# Altium project main-module-60mmPIC.PrjPcb
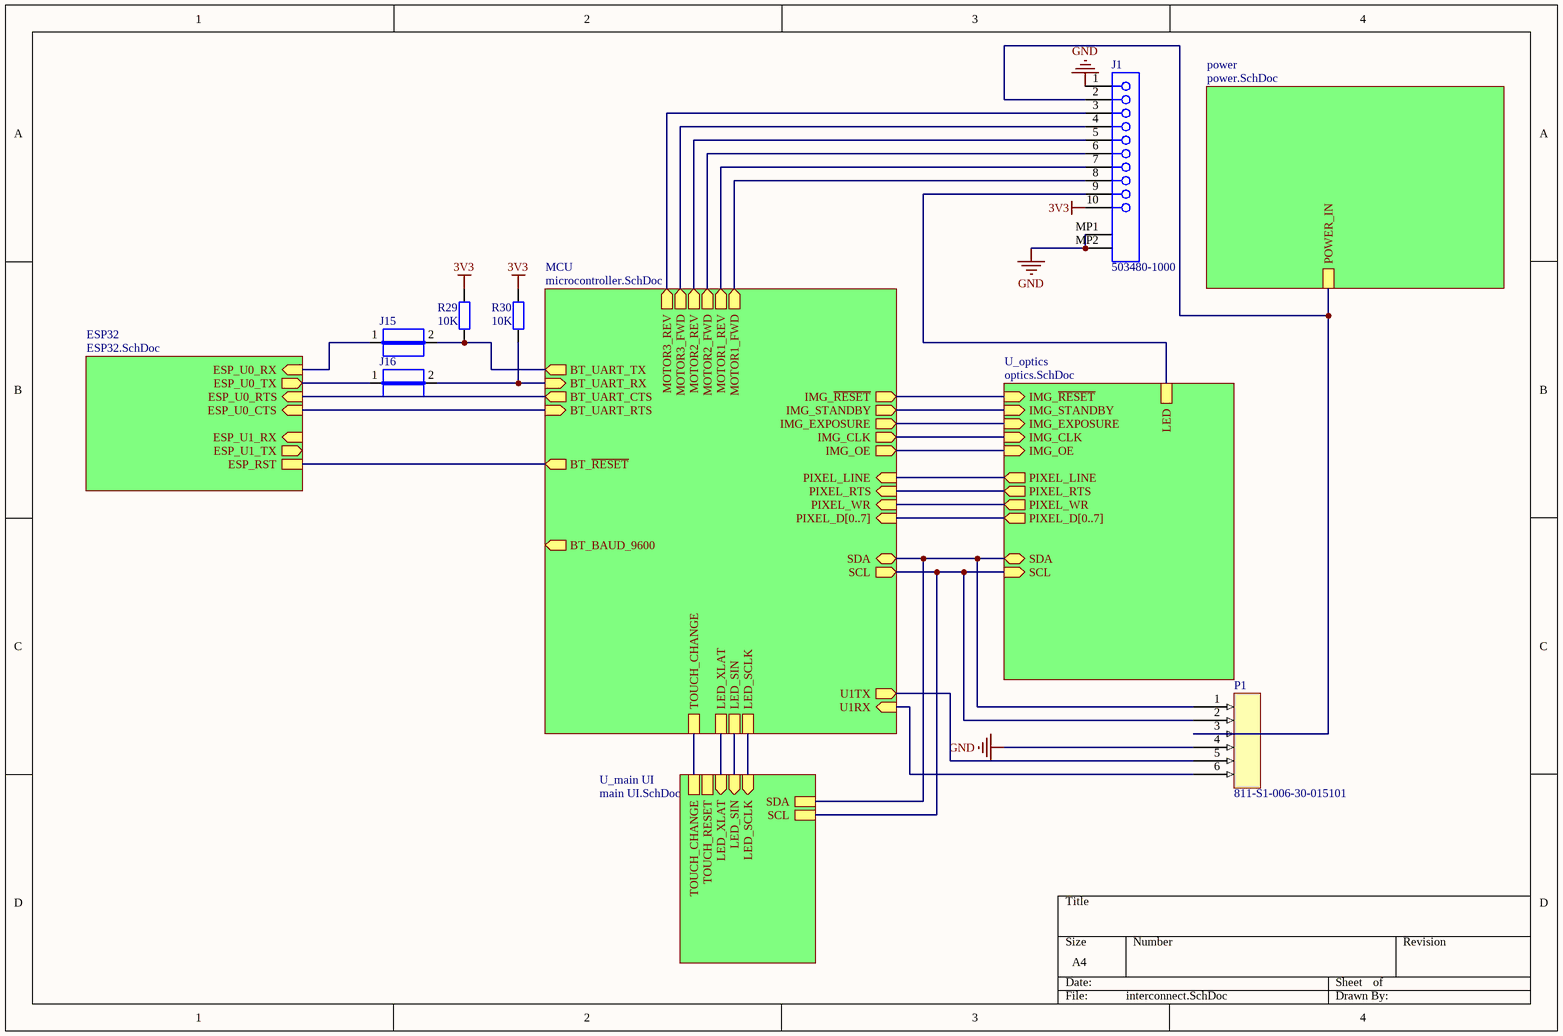
[diagram p0: interconnect.SchDoc]
6 sheets, 102 parts. Net scope: hierarchical (ports join the sheet entries above them; power ports are global).
Board file: main-module-60mmPIC.PcbDoc
Sheets:
  interconnect.SchDoc
    ESP32 = ESP32.SchDoc
    power = power.SchDoc
    MCU = microcontroller.SchDoc
    U_optics = optics.SchDoc
    U_main UI = main UI.SchDoc

## Sheet interconnect.SchDoc
size A4; SheetNumber: 1; SheetTotal: 6

### Parts
J1  503480-1000  [MOLX-503480-1000]
J15  JUMPER  [JUMPER]  (value not drawn)
J16  JUMPER  [JUMPER]  (value not drawn)
P1  811-S1-006-30-015101  [New footprint 1]
R29  10K  [1608[0603]_M]
R30  10K  [1608[0603]_M]

### Sub-sheets
ESP32 = ESP32.SchDoc: ESP_U0_RX (in), ESP_U1_TX (out), ESP_U0_TX (out), ESP_U1_RX (in), ESP_U0_CTS (in), ESP_U0_RTS (in), ESP_RST
MCU = microcontroller.SchDoc: SDA (bidir), IMG_STANDBY (out), IMG_EXPOSURE (out), BT_UART_RTS (in), BT_UART_CTS (out), MOTOR1_FWD (out), MOTOR1_REV (out), MOTOR2_FWD (out), MOTOR2_REV (out), MOTOR3_FWD (out), BT_~{RESET} (out), IMG_~{RESET} (out), IMG_CLK (out), PIXEL_LINE (in), IMG_OE (out), BT_BAUD_9600 (out), PIXEL_RTS (in), PIXEL_WR (in), MOTOR3_REV (out), SCL (out), PIXEL_D[0..7] (in), LED_SIN, TOUCH_CHANGE, LED_XLAT, LED_SCLK, BT_UART_TX (out), BT_UART_RX (in), U1TX (out), U1RX (in)
power = power.SchDoc: POWER_IN
U_main UI = main UI.SchDoc: LED_SCLK (in), LED_SIN (in), LED_XLAT (in), SDA, TOUCH_RESET, TOUCH_CHANGE, SCL
U_optics = optics.SchDoc: IMG_~{RESET} (in), IMG_CLK (in), IMG_EXPOSURE (in), IMG_STANDBY (in), SCL (in), SDA (bidir), PIXEL_WR (out), PIXEL_RTS (out), PIXEL_D[0..7] (out), PIXEL_LINE (out), IMG_OE (in), LED

### Nets
3V3: J1.10 R29.2 R30.2
GND: J1.1 J1.MP1 J1.MP2 P1.4
E32_RST: sheet ESP32/ESP_RST, sheet MCU/BT_~{RESET}
IMG_CLK: sheet MCU/IMG_CLK, sheet U_optics/IMG_CLK
IMG_EXPOSURE: sheet MCU/IMG_EXPOSURE, sheet U_optics/IMG_EXPOSURE
LED_SCLK: sheet MCU/LED_SCLK, sheet U_main UI/LED_SCLK
LED_SIN: sheet MCU/LED_SIN, sheet U_main UI/LED_SIN
LED_XLAT: sheet MCU/LED_XLAT, sheet U_main UI/LED_XLAT
PIXEL_WR: sheet MCU/PIXEL_WR, sheet U_optics/PIXEL_WR
SCL: P1.2 ; sheet MCU/SCL, sheet U_optics/SCL, sheet U_main UI/SCL
SDA: P1.1 ; sheet MCU/SDA, sheet U_optics/SDA, sheet U_main UI/SDA
TOUCH_~{CHANGE}: sheet MCU/TOUCH_CHANGE, sheet U_main UI/TOUCH_CHANGE
U0RXD: J15.1 ; sheet ESP32/ESP_U0_RX
U0TXD: J16.1 ; sheet ESP32/ESP_U0_TX
NetC5_1: J1.2 P1.3 ; sheet power/POWER_IN
NetIC1_4: J15.2 R29.1 ; sheet MCU/BT_UART_TX
NetIC1_5: J16.2 R30.1 ; sheet MCU/BT_UART_RX
NetIC1_6: sheet ESP32/ESP_U0_CTS, sheet MCU/BT_UART_RTS
NetIC1_10: sheet ESP32/ESP_U0_RTS, sheet MCU/BT_UART_CTS
NetIC1_11: P1.6 ; sheet MCU/U1RX
NetIC1_13: P1.5 ; sheet MCU/U1TX
NetIC1_14: J1.8 ; sheet MCU/MOTOR1_FWD
NetIC1_17: J1.7 ; sheet MCU/MOTOR1_REV
NetIC1_18: J1.6 ; sheet MCU/MOTOR2_FWD
NetIC1_21: J1.5 ; sheet MCU/MOTOR2_REV
NetIC1_22: J1.4 ; sheet MCU/MOTOR3_FWD
NetIC1_23: J1.3 ; sheet MCU/MOTOR3_REV
NetIC1_45: sheet MCU/PIXEL_RTS, sheet U_optics/PIXEL_RTS
NetIC1_46: sheet MCU/IMG_OE, sheet U_optics/IMG_OE
NetIC1_50: sheet MCU/IMG_~{RESET}, sheet U_optics/IMG_~{RESET}
NetIC1_56: sheet MCU/IMG_STANDBY, sheet U_optics/IMG_STANDBY
NetIC1_57: sheet MCU/PIXEL_LINE, sheet U_optics/PIXEL_LINE
NetJ1_9: J1.9 ; sheet U_optics/LED

### Buses and harness runs
bus sheet MCU/PIXEL_D[0..7] = sheet U_optics/PIXEL_D[0..7]

### Library data of the parts
J1 = CMP-1241-00115-1: 0.5 mm Pitch Easy-On(TM) BackFlip(TM) Type FPC Connector, 1.0 mm Mated Height, Right Angle, SMT, Dual Contact, 10 Circuits, -40 to 85 degC, ELV and RoHS Compliant, Tape and Reel; Manufacturer: Molex; Durability (mating cycles max): 10; Pitch - Mating Interface: 0.50mm; Material - Plating Mating: Gold; Voltage (Max): 50V AC (RMS)/DC; Polarized to PCB: Yes; PCB Locator: No; Current (Max per Contact): 0.5A; Material - Plating Termination: Gold, Tin; Entry Angle: 90degrees Angle; Mated Height: 1.00mm; Material - Metal: Phosphor Bronze; ComponentLink1Description: Manufacturer URL; PartNumber: 503480-1000; Circuits (Loaded): 10; Packing: Tape and Reel; PackageReference: 503480-1000; ComponentLink2URL: http://www.molex.com/webdocs/datasheets/pdf/en-us/5034801000_FFC_FPC_CONNECTORS.pdf; PackageVersion: Rev. F, 09/2012; ComponentLink3Description: Package Specification; ComponentLink3URL: http://www.molex.com/pdm_docs/sd/5034801000_sd.pdf; PackageDescription: 10-Lead FPC Connector, Pitch 0.5 mm; Stackable: No; Mounting Technology: Surface Mount; ComponentLink2Description: Datasheet; PCB Retention: Yes; Number of Rows: 1; Orientation: Right Angle; Contact Position: Dual; RoHS: TRUE; ComponentLink1URL: http://www.molex.com/molex/index.jsp
J15 J16 = CMP-009-00061-1: Pins: 2
P1 = CMP-002-00071-6: Conn Spring Piston 6POS SMD
R29 R30 = Resistor: Generic Resistor; Value: 10K

## Sheet ESP32.SchDoc
size A4; SheetNumber: 2; SheetTotal: 6
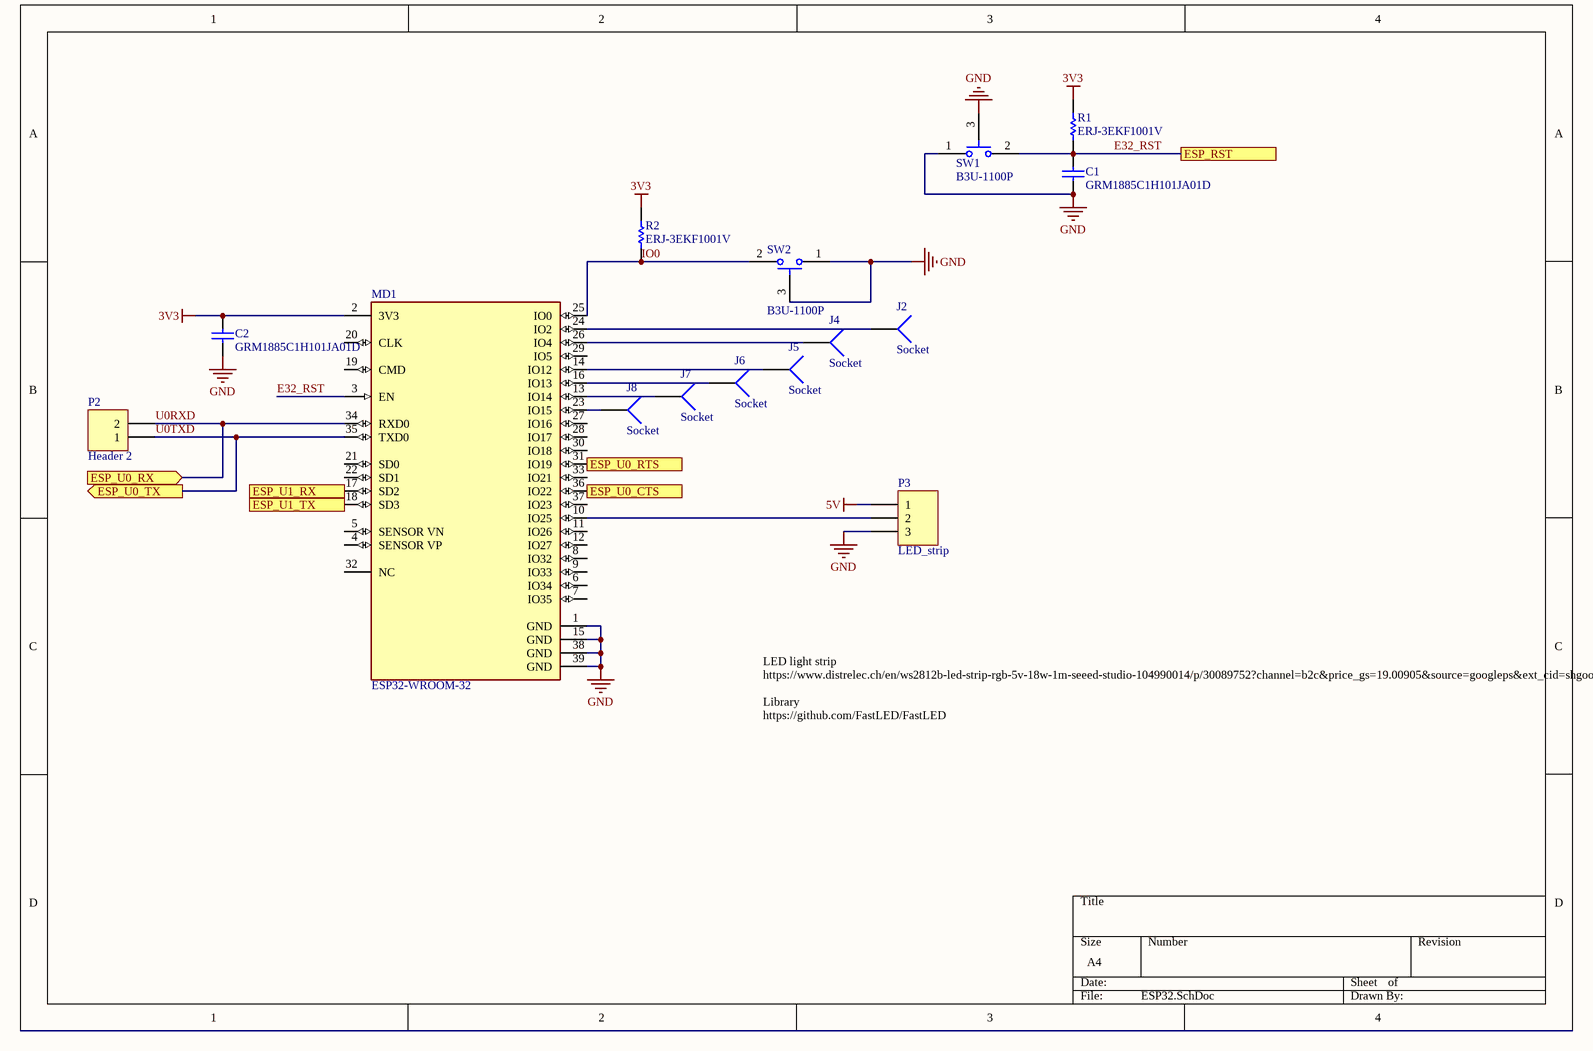
[diagram p1: ESP32.SchDoc]

### Parts
C1  GRM1885C1H101JA01D  [CAPC1608X90X35ML10T15]
C2  GRM1885C1H101JA01D  [CAPC1608X90X35ML10T15]
J2  Socket  [PIN1]
J4  Socket  [PIN1]
J5  Socket  [PIN1]
J6  Socket  [PIN1]
J7  Socket  [PIN1]
J8  Socket  [PIN1]
MD1  ESP32-WROOM-32  [FP-ESP32-WROOM-32-MFG]
P2  Header 2  [HDR1X2]
P3  LED_strip  [HDR1X3]
R1  ERJ-3EKF1001V  [RESC1608X55X30ML15T15]
R2  ERJ-3EKF1001V  [RESC1608X55X30ML15T15]
SW1  B3U-1100P  [FP-B3U-1100P-MFG]
SW2  B3U-1100P  [FP-B3U-1100P-MFG]

### Ports
ESP_RST, ESP_U0_CTS (in), ESP_U0_RTS (in), ESP_U0_RX (in), ESP_U0_TX (out), ESP_U1_RX (in), ESP_U1_TX (out)

### Nets
3V3: C2.2 MD1.2(3V3) R1.2 R2.2
5V: P3.1
GND: C1.1 C2.1 MD1.1(GND) MD1.15(GND) MD1.38(GND) MD1.39(GND) P3.3 SW1.1 SW1.3 SW2.1 SW2.3
E32_RST: C1.2 MD1.3(EN) R1.1 SW1.2 ; port ESP_RST
IO0: MD1.25(IO0) R2.1 SW2.2
U0RXD: MD1.34(RXD0) P2.2 ; port ESP_U0_RX
U0TXD: MD1.35(TXD0) P2.1 ; port ESP_U0_TX
NetIC1_6: MD1.36(IO22) ; port ESP_U0_CTS
NetIC1_10: MD1.31(IO19) ; port ESP_U0_RTS
NetJ2_1: J2.1 MD1.24(IO2)
NetJ4_1: J4.1 MD1.26(IO4)
NetJ5_1: J5.1 MD1.14(IO12)
NetJ6_1: J6.1 MD1.16(IO13)
NetJ7_1: J7.1 MD1.13(IO14)
NetJ8_1: J8.1 MD1.23(IO15)
NetMD1_10: MD1.10(IO25) P3.2
NetMD1_17: MD1.17(SD2) ; port ESP_U1_RX
NetMD1_18: MD1.18(SD3) ; port ESP_U1_TX

Not connected (* = marked no-connect by the designer): MD1 4(SENSOR_VP) 5(SENSOR_VN) 6(IO34) 7(IO35) 8(IO32) 9(IO33) 11(IO26) 12(IO27) 19(CMD) 20(CLK) 21(SD0) 22(SD1) 27(IO16) 28(IO17) 29(IO5) 30(IO18) 32(NC) 33(IO21) 37(IO23)

### Notes on the sheet
- LED light strip
  https://www.distrelec.ch/en/ws2812b-led-strip-rgb-5v-18w-1m-seeed-studio-104990014/p/30089752?channel=b2c&price_gs=19.00905&source=googleps&ext_cid=shgooaqchen-blcss&kw=%7Bkeyword%7D&ext_cid=shgooaqchen-P-CSS-Shopping-Lighting&pi=30089752&gclid=CjwKCAjww-CGBhALEiwAQzWxOvH7Gs9yD2iBi4Gc1DNC2TtA9CMgRWs6OTP8T3pO5lNEQTRO2M92tBoC6-AQAvD_BwE
  Library
  https://github.com/FastLED/FastLED

### Library data of the parts
C1 C2 = CMP-2006-02595-1: Manufacturer: Murata; Part Number: GRM1885C1H101JA01D
MD1 = CMP-194065-000008-1: RX TXRX MOD WIFI SURFACE MOUNT; Frequency: 2.5GHz; Sensitivity: -98dBm; Operating Supply Voltage: 3.6V; Data Rate: 150Mbps; Weight: 0.088185oz; Package Quantity: 550; Min Operating Temperature: -40°C; Mount: Surface Mount; Max Operating Temperature: 85°C; Packaging: Cut Tape; Case/Package: SMD/SMT
P2 = Header 2: Header, 2-Pin; LatestRevisionDate: 17-Jul-2002; LatestRevisionNote: Re-released for DXP Platform.; Publisher: Altium Limited
P3 = Header 3: Header, 3-Pin; LatestRevisionDate: 17-Jul-2002; LatestRevisionNote: Re-released for DXP Platform.; Publisher: Altium Limited
R1 R2 = CMP-2000-00180-1: Manufacturer: Panasonic; Part Number: ERJ-3EKF1001V
SW1 SW2 = CMP-2000-05903-2: SWITCH TACTILE SPST-NO 0.05A 12V; Switch Function: Off-Mom; Operating Force: 1.5N; Mechanical Life: 200000Cycles; Max Current Rating: 50mA; Illumination Type: Non-Illuminated; Actuator Type: Standard; Throw Configuration: SPST; Switch Travel: 0.15mm; Contact Resistance: 100mR; Actuator Length: 0.4mm; Ratings: Dust Proof; Termination: SMD/SMT; Packaging: Tape and Reel; Contact Plating: Silver; Max Operating Temperature: 70°C; Current Rating: 50mA; Electrical Life: 200000Cycles; Voltage Rating (DC): 12V; Length: 3.15mm; Weight: 0.022g; Min Operating Temperature: -25°C; Orientation: Straight; Contact Current Rating: 50mA; Package Quantity: 1; Max Voltage Rating (DC): 12V; Depth: 4mm; Lead Free: Lead Free; Mount: Surface Mount
J2 J4-J8 = Socket: LatestRevisionDate: 17-Jul-2002; LatestRevisionNote: Re-released for DXP Platform.; Publisher: Altium Limited

## Sheet power.SchDoc
size A4; SheetNumber: 3; SheetTotal: 6
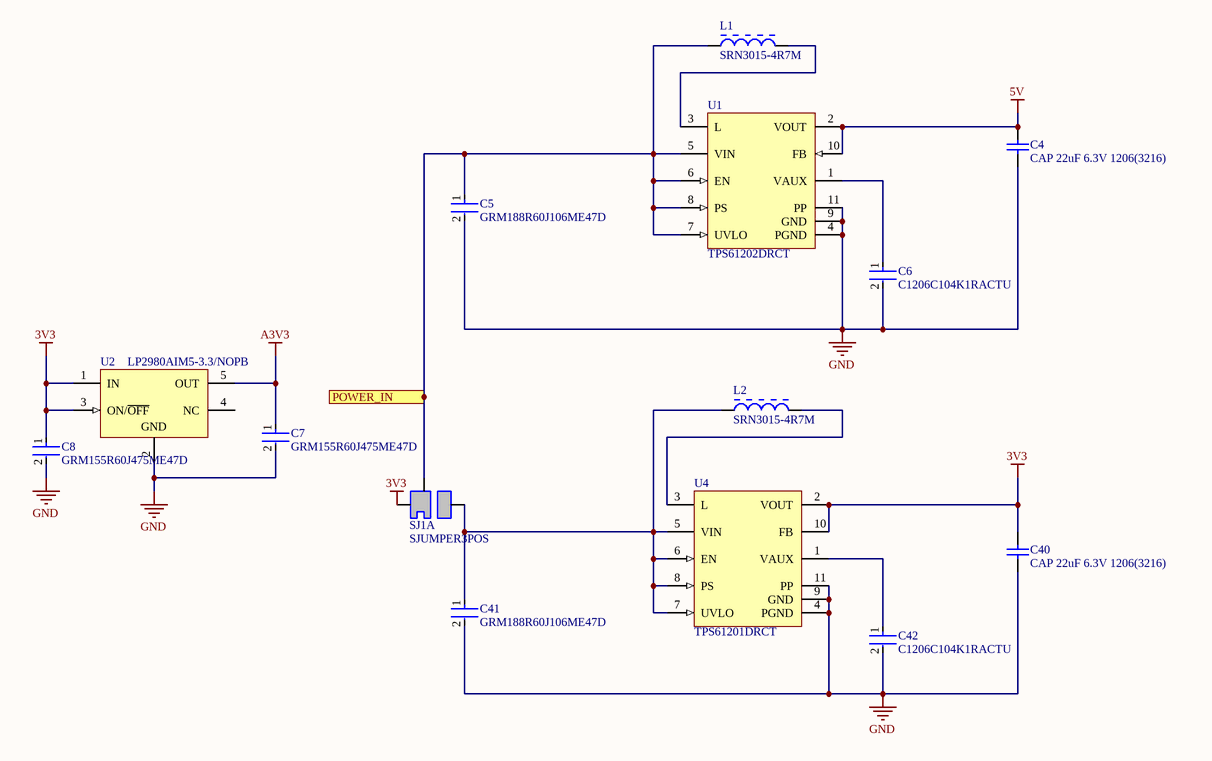
[diagram p2: power.SchDoc]

### Parts
C4  CAP 22uF 6.3V 1206(3216)  [CAPC1206(3216)190_M]
C5  GRM188R60J106ME47D  [FP-GRM188-0_1-e0_2_0_55-MFG]
C6  C1206C104K1RACTU  [FP-C1206C-EB-MFG]
C7  GRM155R60J475ME47D  [FP-GRM155-0_1-IPC_B]
C8  GRM155R60J475ME47D  [FP-GRM155-0_1-IPC_B]
C40  CAP 22uF 6.3V 1206(3216)  [CAPC1206(3216)190_M]
C41  GRM188R60J106ME47D  [FP-GRM188-0_1-e0_2_0_55-MFG]
C42  C1206C104K1RACTU  [FP-C1206C-EB-MFG]
L1  SRN3015-4R7M  [BOUR-SRN3015-2_V]
L2  SRN3015-4R7M  [BOUR-SRN3015-2_V]
SJ1  SJUMPER3POS  [SJUMPER3POS-Footprint-1]  (part A of 2)
U1  TPS61202DRCT  [DRC0010J_V]
U2  LP2980AIM5-3.3/NOPB  [MF05A_L]
U4  TPS61201DRCT  [DRC0010J_V]

### Ports
POWER_IN

### Nets
3V3: C8.1 C40.2 SJ1.1 U2.1(IN) U2.3(ON/~{OFF}) U4.2(VOUT) U4.10(FB)
5V: C4.2 U1.2(VOUT) U1.10(FB)
A3V3: C7.1 U2.5(OUT)
GND: C4.1 C5.2 C6.2 C7.2 C8.2 C40.1 C41.2 C42.2 U1.4(PGND) U1.9(GND) U1.11(PP) U2.2(GND) U4.4(PGND) U4.9(GND) U4.11(PP)
NetC5_1: C5.1 L1.1 SJ1.2 U1.5(VIN) U1.6(EN) U1.7(UVLO) U1.8(PS) ; port POWER_IN
NetC6_1: C6.1 U1.1(VAUX)
NetC41_1: C41.1 L2.1 SJ1.3 U4.5(VIN) U4.6(EN) U4.7(UVLO) U4.8(PS)
NetC42_1: C42.1 U4.1(VAUX)
NetL1_2: L1.2 U1.3(L)
NetL2_2: L2.2 U4.3(L)

Not connected (* = marked no-connect by the designer): U2 4(NC)

### Library data of the parts
C4 C40 = CMP-1037-04986-1: CAP 22uF 6.3V ±20% 1206 (3216 Metric) Thickness 1.9mm SMD; Case-EIA: 1206; Tolerance: Â±20%; Case-Metric: 3216; Value: 22uF; Max Thickness: 1.9 mm; Rated Voltage: 6.3 V; Technology: SMT
C5 C41 = CMP-2006-02792-2: Chip Multilayer Ceramic Capacitors for General Purpose, 0603, 10uF, X5R, 15%, 20%, 6.3V; Packaging: Tape and Reel; Voltage Rating (DC): 6.3V; Width: 0.031inch; Termination: SMD/SMT; Dielectric: X5R; Package Quantity: 4000; Voltage Rating: 6.3V; Capacitance: 10uF; Case/Package: 0603; Min Operating Temperature: -55°C; Voltage: 6.3V; Length: 1.6mm; Thickness: 0.035inch; Lead Free: Lead Free; Depth: 0.8mm; Case Code (Imperial): 0603; Max Operating Temperature: 85°C; Material: Ceramic; Height: 0.8mm; Tolerance: 20%; Mount: Surface Mount; REACH SVHC: No SVHC; Radiation Hardening: No; Case Code (Metric): 1608
C6 C42 = CMP-03020-000153-1: CAP CER 0.1UF 100V X7R 1206; Manufacturer: KEMET; Value: 0.10 μF; Tolerance: 0.1; Material: Ceramic; Temperature Coefficient: 15%; Automotive Grade: Grade 0; Voltage Rating: 100 V; Automotive: Yes; Ipc Land Pattern Name: CAPC320160X78; Device Class L1: Passive Components; ComponentLink2Description: Datasheet; Temperature Range Low: -55°C; Category: Cap; Octopart: https://octopart.com/c1206c104k1ractu-kemet-89521; Height: 0.88mm; Lead Free: Yes; Digikey Description: CAP CER 0.1UF 100V X7R 1206; Mouser Description: CAP CER 0.1UF 100V X7R 1206; Device Class L3: Ceramic Capacitors; Device Class L2: Capacitors; ComponentLink2URL: https://content.kemet.com/datasheets/KEM_C1007_X8R_ULTRA_150C_SMD.pdf; Temperature Range High: +150°C; Temperature Characteristic: X7R; Manufacturer Part Number: C1206C104K1RACTU; RoHS: TRUE; Capacitance: 0.10 μF; Package: C1206C-EB; Temperature: -55°C to +150°C
C7 C8 = CMP-2008-04549-2: Chip Multilayer Ceramic Capacitors for General Purpose, 0402, 4.7uF, X5R, 15%, 20%, 6.3V; Height: 0.5mm; Weight: 0.000212oz; Length: 1mm; Case Code (Metric): 1005; Packaging: Tape and Reel; Termination: SMD/SMT; Dielectric: X5R; Depth: 0.5mm; Case Code (Imperial): 0402; Min Operating Temperature: -55°C; Case/Package: 0402; Voltage: 6.3V; Width: 0.02inch; Capacitance: 4.7uF; Lead Free: Lead Free; Thickness: 0.022inch; Contact Plating: Tin; REACH SVHC: No SVHC; Package Quantity: 10000; Tolerance: 20%; Voltage Rating (DC): 6.3V; Voltage Rating: 6.3V; Mount: Surface Mount; Max Operating Temperature: 85°C
L1 L2 = CMP-0007-00005-1: Semi-shielded Power Inductor, 4.7 uH, +/- 20%, 1.4 A, -40 to 125 degC, 3 x 3 x 1.5 mm SMD, RoHS and Halogen Free, Tape and Reel; Manufacturer: Bourns; SRF Min: 65 MHz; Inductance: 4.7 uH; Isat: 1.2 A; Resistance to Solder Heat: +260 degC for 10 sec.; Rated current: 1.4 A; Inductance tolerance: +/- 20%; DCR Max: 0.136 Ohm; RoHS: TRUE; ComponentLink2Description: Datasheet; PackageDescription: 2-Pin SMD, Body 3 x 3 mm, Height 1.5 mm; ComponentLink2URL: http://www.bourns.com/data/global/pdfs/SRN3015.pdf; ComponentLink1URL: http://www.bourns.com/; Packing: Tape and Reel; Mounting Technology: Surface Mount; ComponentLink3URL: http://www.bourns.com/data/global/pdfs/SRN3015.pdf; PackageReference: SRN3015; Operating Temperature: -40 to 125 degC; DatasheetVersion: Aug-11; ComponentLink1Description: Manufacturer URL; ComponentLink3Description: Package Specification; PartNumber: SRN3015-4R7M
SJ1 = CMP-001-0001-1: 3 pins solder jumper
U1 = CMP-0347-00032-2: Boost Voltage Converter with 0.3 to 5.5 V Input and 5 V Output, -40 to 85 degC, 10-Pin SON (DRC), Green (RoHS & no Sb/Br); Manufacturer: Texas Instruments; Vin(Min)(V): 0.3; Vin(Max)(V): 5.5; Switching Frequency(Max)(kHz): 1250; SubFamily: Step-Up Regulator; Preset Vout(V): 5; Synchronous Rectification: TRUE; Regulated Outputs(#): 1; PackageVersion: revL, Sep-2011; Topology: Boost; PackageDescription: 10-Pin Plastic Small Outline No-Lead, 3 x 3 x 1 mm Body, 0.5 mm Pitch, Exposed Pad; PackageReference: DRC0010J; ComponentLink2Description: Package Specification; ComponentLink1URL: http://www.ti.com/general/docs/lit/getliterature.tsp?genericPartNumber=TPS61202&fileType=pdf; Eco-Plan: Green (RoHS & no Sb/Br); Mounting Technology: Surface Mount; DatasheetVersion: SLVS577B; PartNumber: TPS61202DRCT; Vout(Max)(V): 5; ComponentLink1Description: Datasheet; ComponentLink2URL: http://www.ti.com/litv/pdf/mpds117k; Vout(Min)(V): 5
U2 = CMP-0062-02170-2: Micropower 50 mA Ultra Low-Dropout Regulator, 5-pin SOT-23, Pb-Free; Manufacturer: National Semiconductor; PowerWise: N; CompType: LDO IC; PackageTopMarking: L00A*XTT; PackageReference: MF05A; DatasheetVersion: Sep-2006; PinCount: 5; ComponentLink3Description: MF05A Package Page; ComponentLink1URL: http://www.national.com/ds/LP/LP2980.pdf; PackageDescription: Molded SOT-23, .115 x .063 x .040 in Body, 5 Lead, .0375 in Pitch; RoHS: Y; RevisionNote: Component URLs added; ComponentLink3URL: http://www.national.com/packaging/folders/mf05a.html; PackageVersion: revD, Aug-2008; ComponentLink1Description: LP2980 Datasheet; ComponentLink2Description: LP2980 Web Page; ComponentLink2URL: http://www.national.com/pf/LP/LP2980.html
U4 = CMP-0343-00033-2: Boost Voltage Converter with 0.3 to 5.5 V Input and 3.3 V Output, -40 to 85 degC, 10-Pin SON (DRC), Green (RoHS & no Sb/Br); Manufacturer: Texas Instruments; Switching Frequency(Max)(kHz): 1250; Vin(Min)(V): 0.3; Preset Vout(V): 3.3; Vin(Max)(V): 5.5; Regulated Outputs(#): 1; Synchronous Rectification: TRUE; SubFamily: Step-Up Regulator; ComponentLink2Description: Package Specification; PackageVersion: revL, Sep-2011; DatasheetVersion: SLVS577B; PackageReference: DRC0010J; PackageDescription: 10-Pin Plastic Small Outline No-Lead, 3 x 3 x 1 mm Body, 0.5 mm Pitch, Exposed Pad; Vout(Min)(V): 3.3; ComponentLink1URL: http://www.ti.com/general/docs/lit/getliterature.tsp?genericPartNumber=TPS61201&fileType=pdf; ComponentLink1Description: Datasheet; Topology: Boost; Mounting Technology: Surface Mount; ComponentLink2URL: http://www.ti.com/litv/pdf/mpds117k; PartNumber: TPS61201DRCT; Eco-Plan: Green (RoHS & no Sb/Br); Vout(Max)(V): 3.3

## Sheet microcontroller.SchDoc
size A4; SheetNumber: 4; SheetTotal: 6
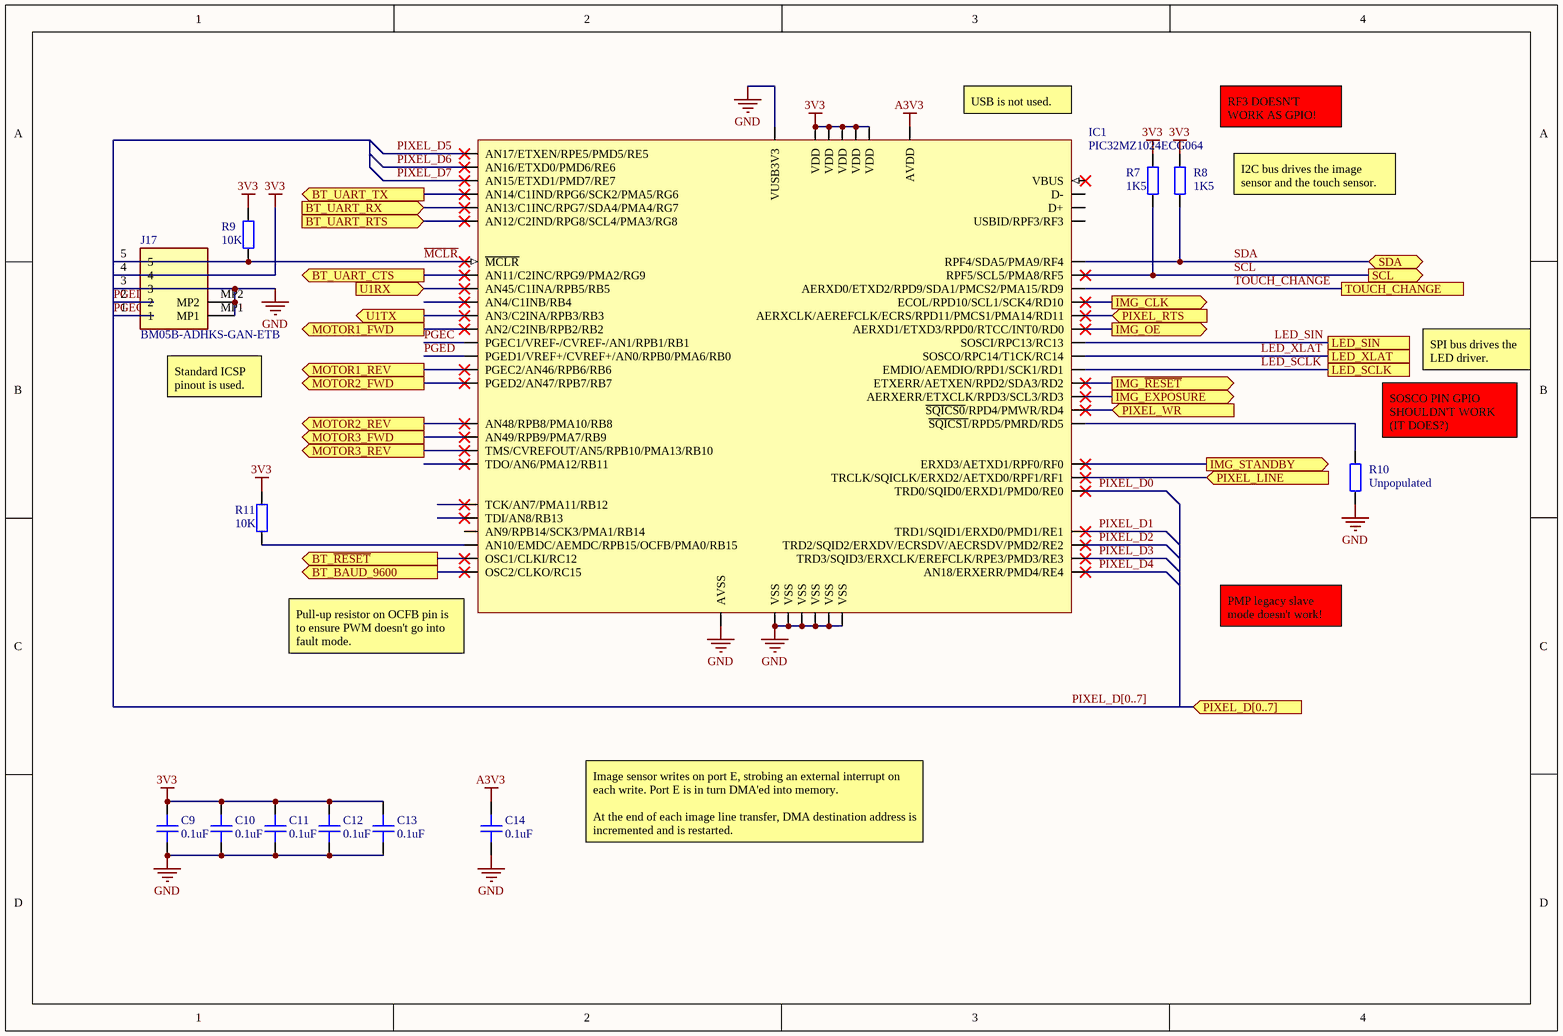
[diagram p3: microcontroller.SchDoc]

### Parts
C9  0.1uF  [1608[0603]_M]
C10  0.1uF  [1608[0603]_M]
C11  0.1uF  [1608[0603]_M]
C12  0.1uF  [1608[0603]_M]
C13  0.1uF  [1608[0603]_M]
C14  0.1uF  [1608[0603]_M]
IC1  PIC32MZ1024ECG064  [TQFP-64_M]
J17  BM05B-ADHKS-GAN-ETB  [BM05BADHKSGANETB]
R7  1K5  [1608[0603]_M]
R8  1K5  [1608[0603]_M]
R9  10K  [1608[0603]_M]
R10  Unpopulated  [1608[0603]_M]
R11  10K  [1608[0603]_M]

### Ports
BT_BAUD_9600 (out), BT_UART_CTS (out), BT_UART_RTS (in), BT_UART_RX (in), BT_UART_TX (out), BT_~{RESET} (out), IMG_CLK (out), IMG_EXPOSURE (out), IMG_OE (out), IMG_STANDBY (out), IMG_~{RESET} (out), LED_SCLK, LED_SIN, LED_XLAT, MOTOR1_FWD (out), MOTOR1_REV (out), MOTOR2_FWD (out), MOTOR2_REV (out), MOTOR3_FWD (out), MOTOR3_REV (out), PIXEL_D[0..7] (in), PIXEL_LINE (in), PIXEL_RTS (in), PIXEL_WR (in), SCL (out), SDA (bidir), TOUCH_CHANGE, U1RX (in), U1TX (out)

### Nets
3V3: C9.2 C10.2 C11.2 C12.2 C13.2 IC1.8(VDD) IC1.26(VDD) IC1.39(VDD) IC1.54(VDD) IC1.60(VDD) J17.4 R7.2 R8.2 R9.2 R11.2
A3V3: C14.2 IC1.19(AVDD)
GND: C9.1 C10.1 C11.1 C12.1 C13.1 C14.1 IC1.7(VSS) IC1.20(AVSS) IC1.25(VSS) IC1.34(VUSB3V3) IC1.35(VSS) IC1.40(VSS) IC1.55(VSS) IC1.59(VSS) J17.3 J17.MP1 J17.MP2 R10.1
E32_RST: IC1.31(OSC1/CLKI/RC12) ; port BT_~{RESET}
IMG_CLK: IC1.44(ECOL/RPD10/SCL1/SCK4/RD10) ; port IMG_CLK
IMG_EXPOSURE: IC1.51(AERXERR/ETXCLK/RPD3/SCL3/RD3) ; port IMG_EXPOSURE
LED_SCLK: IC1.49(EMDIO/AEMDIO/RPD1/SCK1/RD1) ; port LED_SCLK
LED_SIN: IC1.47(SOSCI/RPC13/RC13) ; port LED_SIN
LED_XLAT: IC1.48(SOSCO/RPC14/T1CK/RC14) ; port LED_XLAT
~{MCLR}: IC1.9(~{MCLR}) J17.5 R9.1
PGEC: IC1.15(PGEC1/VREF-/CVREF-/AN1/RPB1/RB1) J17.1
PGED: IC1.16(PGED1/VREF+/CVREF+/AN0/RPB0/PMA6/RB0) J17.2
PIXEL_D0: IC1.58(TRD0/SQID0/ERXD1/PMD0/RE0)
PIXEL_D1: IC1.61(TRD1/SQID1/ERXD0/PMD1/RE1)
PIXEL_D2: IC1.62(TRD2/SQID2/ERXDV/ECRSDV/AECRSDV/PMD2/RE2)
PIXEL_D3: IC1.63(TRD3/SQID3/ERXCLK/EREFCLK/RPE3/PMD3/RE3)
PIXEL_D4: IC1.64(AN18/ERXERR/PMD4/RE4)
PIXEL_D5: IC1.1(AN17/ETXEN/RPE5/PMD5/RE5)
PIXEL_D6: IC1.2(AN16/ETXD0/PMD6/RE6)
PIXEL_D7: IC1.3(AN15/ETXD1/PMD7/RE7)
PIXEL_WR: IC1.52(~{SQICS0}/RPD4/PMWR/RD4) ; port PIXEL_WR
SCL: IC1.42(RPF5/SCL5/PMA8/RF5) R7.1 ; port SCL
SDA: IC1.41(RPF4/SDA5/PMA9/RF4) R8.1 ; port SDA
TOUCH_~{CHANGE}: IC1.43(AERXD0/ETXD2/RPD9/SDA1/PMCS2/PMA15/RD9) ; port TOUCH_CHANGE
NetIC1_4: IC1.4(AN14/C1IND/RPG6/SCK2/PMA5/RG6) ; port BT_UART_TX
NetIC1_5: IC1.5(AN13/C1INC/RPG7/SDA4/PMA4/RG7) ; port BT_UART_RX
NetIC1_6: IC1.6(AN12/C2IND/RPG8/SCL4/PMA3/RG8) ; port BT_UART_RTS
NetIC1_10: IC1.10(AN11/C2INC/RPG9/PMA2/RG9) ; port BT_UART_CTS
NetIC1_11: IC1.11(AN45/C1INA/RPB5/RB5) ; port U1RX
NetIC1_13: IC1.13(AN3/C2INA/RPB3/RB3) ; port U1TX
NetIC1_14: IC1.14(AN2/C2INB/RPB2/RB2) ; port MOTOR1_FWD
NetIC1_17: IC1.17(PGEC2/AN46/RPB6/RB6) ; port MOTOR1_REV
NetIC1_18: IC1.18(PGED2/AN47/RPB7/RB7) ; port MOTOR2_FWD
NetIC1_21: IC1.21(AN48/RPB8/PMA10/RB8) ; port MOTOR2_REV
NetIC1_22: IC1.22(AN49/RPB9/PMA7/RB9) ; port MOTOR3_FWD
NetIC1_23: IC1.23(TMS/CVREFOUT/AN5/RPB10/PMA13/RB10) ; port MOTOR3_REV
NetIC1_30: IC1.30(AN10/EMDC/AEMDC/RPB15/OCFB/PMA0/RB15) R11.1
NetIC1_32: IC1.32(OSC2/CLKO/RC15) ; port BT_BAUD_9600
NetIC1_45: IC1.45(AERXCLK/AEREFCLK/ECRS/RPD11/PMCS1/PMA14/RD11) ; port PIXEL_RTS
NetIC1_46: IC1.46(AERXD1/ETXD3/RPD0/RTCC/INT0/RD0) ; port IMG_OE
NetIC1_50: IC1.50(ETXERR/AETXEN/RPD2/SDA3/RD2) ; port IMG_~{RESET}
NetIC1_53: IC1.53(~{SQICS1}/RPD5/PMRD/RD5) R10.2
NetIC1_56: IC1.56(ERXD3/AETXD1/RPF0/RF0) ; port IMG_STANDBY
NetIC1_57: IC1.57(TRCLK/SQICLK/ERXD2/AETXD0/RPF1/RF1) ; port PIXEL_LINE

Not connected (* = marked no-connect by the designer): IC1 12(AN4/C1INB/RB4)* 24(TDO/AN6/PMA12/RB11)* 27(TCK/AN7/PMA11/RB12)* 28(TDI/AN8/RB13)* 29(AN9/RPB14/SCK3/PMA1/RB14) 33(VBUS)* 36(D-) 37(D+) 38(USBID/RPF3/RF3)

### Buses and harness runs
bus PIXEL_D[0..7] = port PIXEL_D[0..7]

### Notes on the sheet
- (near IC1) USB is not used.
- RF3 DOESN'T WORK AS GPIO!
- I2C bus drives the image sensor and the touch sensor.
- SPI bus drives the LED driver.
- (near J17) Standard ICSP pinout is used.
- (near R10) SOSCO PIN GPIO SHOULDN'T WORK (IT DOES?)
- (near IC1) Pull-up resistor on OCFB pin is to ensure PWM doesn't go into fault mode.
- PMP legacy slave mode doesn't work!
- Image sensor writes on port E, strobing an external interrupt on each write. Port E is in turn DMA'ed into memory.
  At the end of each image line transfer, DMA destination address is incremented and is restarted.

### Library data of the parts
C9-C14 = Capacitor: Generic Capacitor; Value: 0.1uF
IC1 = CMP-042-000001-1: 32-bit Microcontroller; Source: PIC.SchLib; Design Item ID: PIC32MZ1024ECG064
J17 = BM05B-ADHKS-GAN-ETB: Connector; Manufacturer_Name: JST (JAPAN SOLDERLESS TERMINALS); Datasheet Link: http://www.jst-mfg.com/product/pdf/eng/eADH.pdf?5efba42839880; Height: 1.9mm; Manufacturer_Part_Number: BM05B-ADHKS-GAN-ETB
R7-R11 = Resistor: Generic Resistor
  R7 R8: Value: 1K5
  R9 R11: Value: 10K
  R10: Value: Unpopulated

## Sheet optics.SchDoc
size A4; SheetNumber: 5; SheetTotal: 6
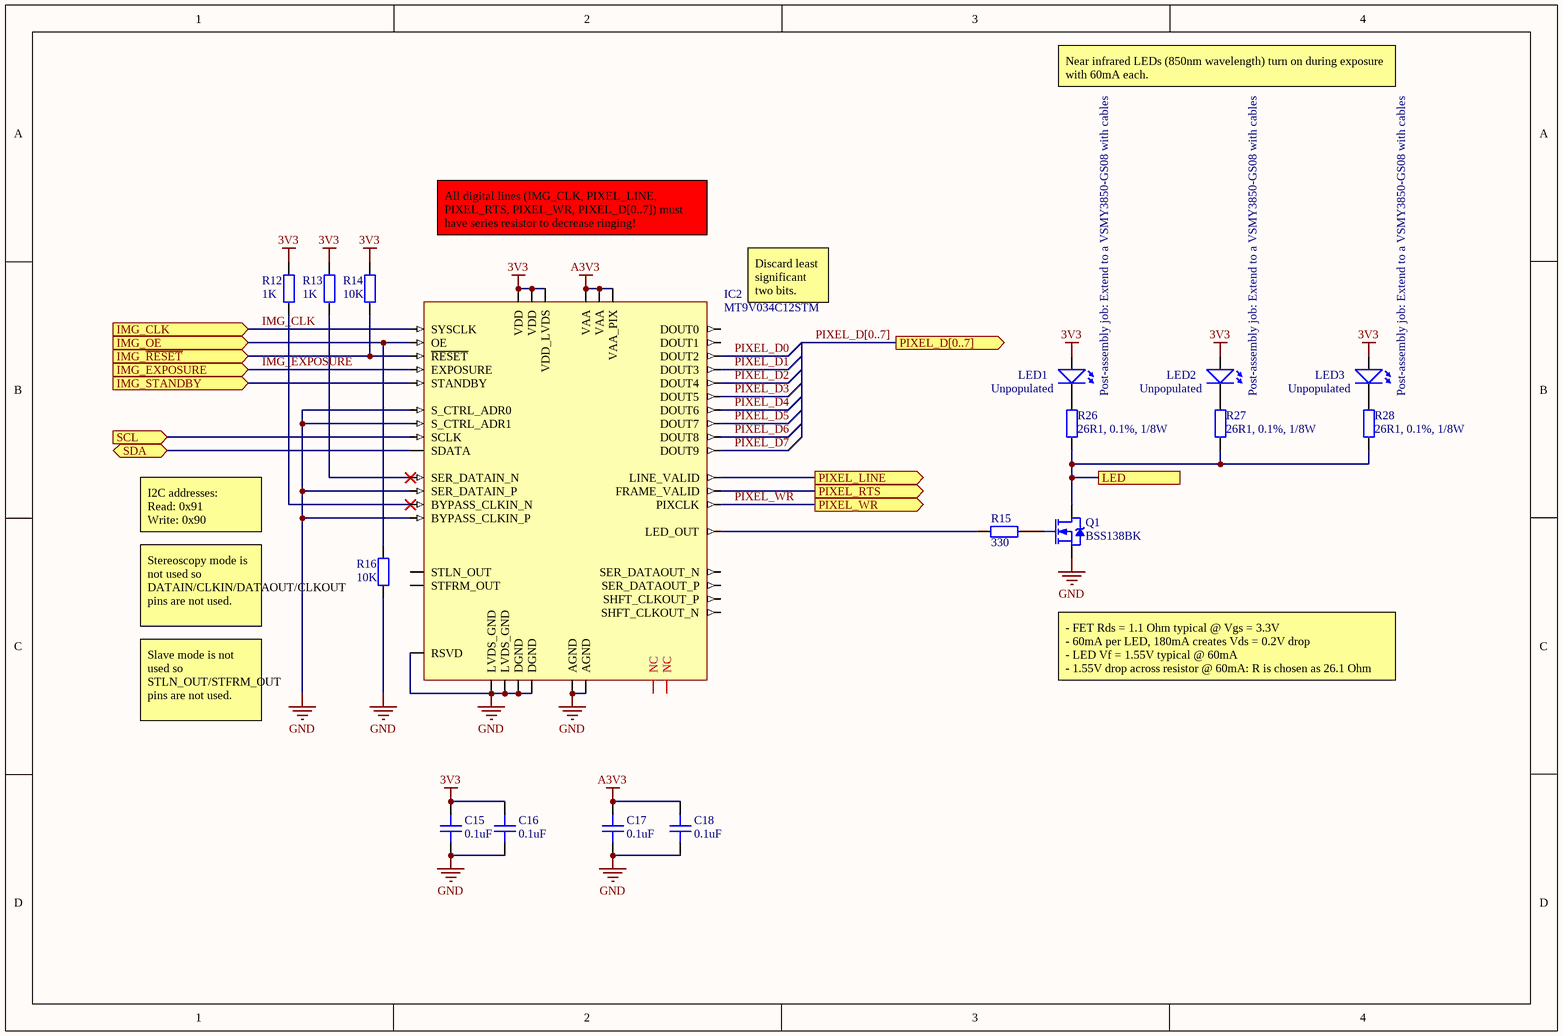
[diagram p4: optics.SchDoc]

### Parts
C15  0.1uF  [1608[0603]_M]
C16  0.1uF  [1608[0603]_M]
C17  0.1uF  [1608[0603]_M]
C18  0.1uF  [1608[0603]_M]
IC2  MT9V034C12STM  [CLCC-48_m]
LED1  Unpopulated  Post-assembly job: Extend to a VSMY3850-GS08 with cables  [CABLE-TERMINAL1x2]
LED2  Unpopulated  Post-assembly job: Extend to a VSMY3850-GS08 with cables  [CABLE-TERMINAL1x2]
LED3  Unpopulated  Post-assembly job: Extend to a VSMY3850-GS08 with cables  [CABLE-TERMINAL1x2]
Q1  BSS138BK  [SOT23-3_N]
R12  1K  [1608[0603]_M]
R13  1K  [1608[0603]_M]
R14  10K  [1608[0603]_M]
R15  330  [1608[0603]_M]
R16  10K  [1608[0603]_M]
R26  26R1, 0.1%, 1/8W  [2012[0805]_M]
R27  26R1, 0.1%, 1/8W  [2012[0805]_M]
R28  26R1, 0.1%, 1/8W  [2012[0805]_M]

### Ports
IMG_CLK (in), IMG_EXPOSURE (in), IMG_OE (in), IMG_STANDBY (in), IMG_~{RESET} (in), LED, PIXEL_D[0..7] (out), PIXEL_LINE (out), PIXEL_RTS (out), PIXEL_WR (out), SCL (in), SDA (bidir)

### Nets
3V3: C15.2 C16.2 IC2.1(VDD) IC2.6(VDD_LVDS) IC2.14(VDD) LED1.A LED2.A LED3.A R12.2 R13.2 R14.2
A3V3: C17.2 C18.2 IC2.35(VAA) IC2.39(VAA) IC2.40(VAA_PIX)
GND: C15.1 C16.1 C17.1 C18.1 IC2.7(LVDS_GND) IC2.9(BYPASS_CLKIN_P) IC2.11(SER_DATAIN_P) IC2.12(LVDS_GND) IC2.13(DGND) IC2.29(RSVD) IC2.30(S_CTRL_ADR0) IC2.31(S_CTRL_ADR1) IC2.34(AGND) IC2.38(AGND) IC2.48(DGND) Q1.S R16.1
IMG_CLK: IC2.47(SYSCLK) ; port IMG_CLK
IMG_EXPOSURE: IC2.23(EXPOSURE) ; port IMG_EXPOSURE
PIXEL_D0: IC2.43(DOUT2)
PIXEL_D1: IC2.42(DOUT3)
PIXEL_D2: IC2.41(DOUT4)
PIXEL_D3: IC2.15(DOUT5)
PIXEL_D4: IC2.16(DOUT6)
PIXEL_D5: IC2.17(DOUT7)
PIXEL_D6: IC2.18(DOUT8)
PIXEL_D7: IC2.19(DOUT9)
PIXEL_WR: IC2.46(PIXCLK) ; port PIXEL_WR
SCL: IC2.25(SCLK) ; port SCL
SDA: IC2.24(SDATA) ; port SDA
NetIC1_45: IC2.21(FRAME_VALID) ; port PIXEL_RTS
NetIC1_46: IC2.28(OE) R16.2 ; port IMG_OE
NetIC1_50: IC2.32(~{RESET}) R14.1 ; port IMG_~{RESET}
NetIC1_56: IC2.33(STANDBY) ; port IMG_STANDBY
NetIC1_57: IC2.20(LINE_VALID) ; port PIXEL_LINE
NetIC2_8: IC2.8(BYPASS_CLKIN_N) R12.1
NetIC2_10: IC2.10(SER_DATAIN_N) R13.1
NetIC2_27: IC2.27(LED_OUT) R15.1
NetJ1_9: Q1.D R26.1 R27.1 R28.1 ; port LED
NetLED1_K: LED1.K R26.2
NetLED2_K: LED2.K R27.2
NetLED3_K: LED3.K R28.2
NetQ1_G: Q1.G R15.2

Not connected (* = marked no-connect by the designer): IC2 2(SHFT_CLKOUT_N) 3(SHFT_CLKOUT_P) 4(SER_DATAOUT_P) 5(SER_DATAOUT_N) 22(STLN_OUT) 26(STFRM_OUT) 36(NC) 37(NC) 44(DOUT1) 45(DOUT0)

### Buses and harness runs
bus PIXEL_D[0..7] = port PIXEL_D[0..7]

### Notes on the sheet
- Near infrared LEDs (850nm wavelength) turn on during exposure with 60mA each.
- All digital lines (IMG_CLK, PIXEL_LINE, PIXEL_RTS, PIXEL_WR, PIXEL_D[0..7]) must have series resistor to decrease ringing!
- (near IC2) Discard least significant two bits.
- I2C addresses:
  Read: 0x91
  Write: 0x90
- Stereoscopy mode is not used so DATAIN/CLKIN/DATAOUT/CLKOUT pins are not used.
- Slave mode is not used so STLN_OUT/STFRM_OUT pins are not used.
- - FET Rds = 1.1 Ohm typical @ Vgs = 3.3V
  - 60mA per LED, 180mA creates Vds = 0.2V drop
  - LED Vf = 1.55V typical @ 60mA
  - 1.55V drop across resistor @ 60mA: R is chosen as 26.1 Ohm

### Library data of the parts
C15-C18 = Capacitor: Generic Capacitor; Value: 0.1uF
IC2 = CMP-025-000000-1: 1/3" WVGA CMOS Image Sensor; Source: ImageSensor.SchLib; Design Item ID: MT9V034C12STM
LED1-LED3 = LED: Generic LED; pin to pad: A>1 K>2; Value: Unpopulated
Q1 = MOSFET-N_BodyDiode: N-channel MOSFET with body diode drawn; pin to pad: D>3 G>1 S>2
R12-R16 R26-R28 = Resistor: Generic Resistor
  R12 R13: Value: 1K
  R14 R16: Value: 10K
  R15: Value: 330
  R26-R28: Value: 26R1, 0.1%, 1/8W

## Sheet main UI.SchDoc
size A4; SheetNumber: 6; SheetTotal: 6
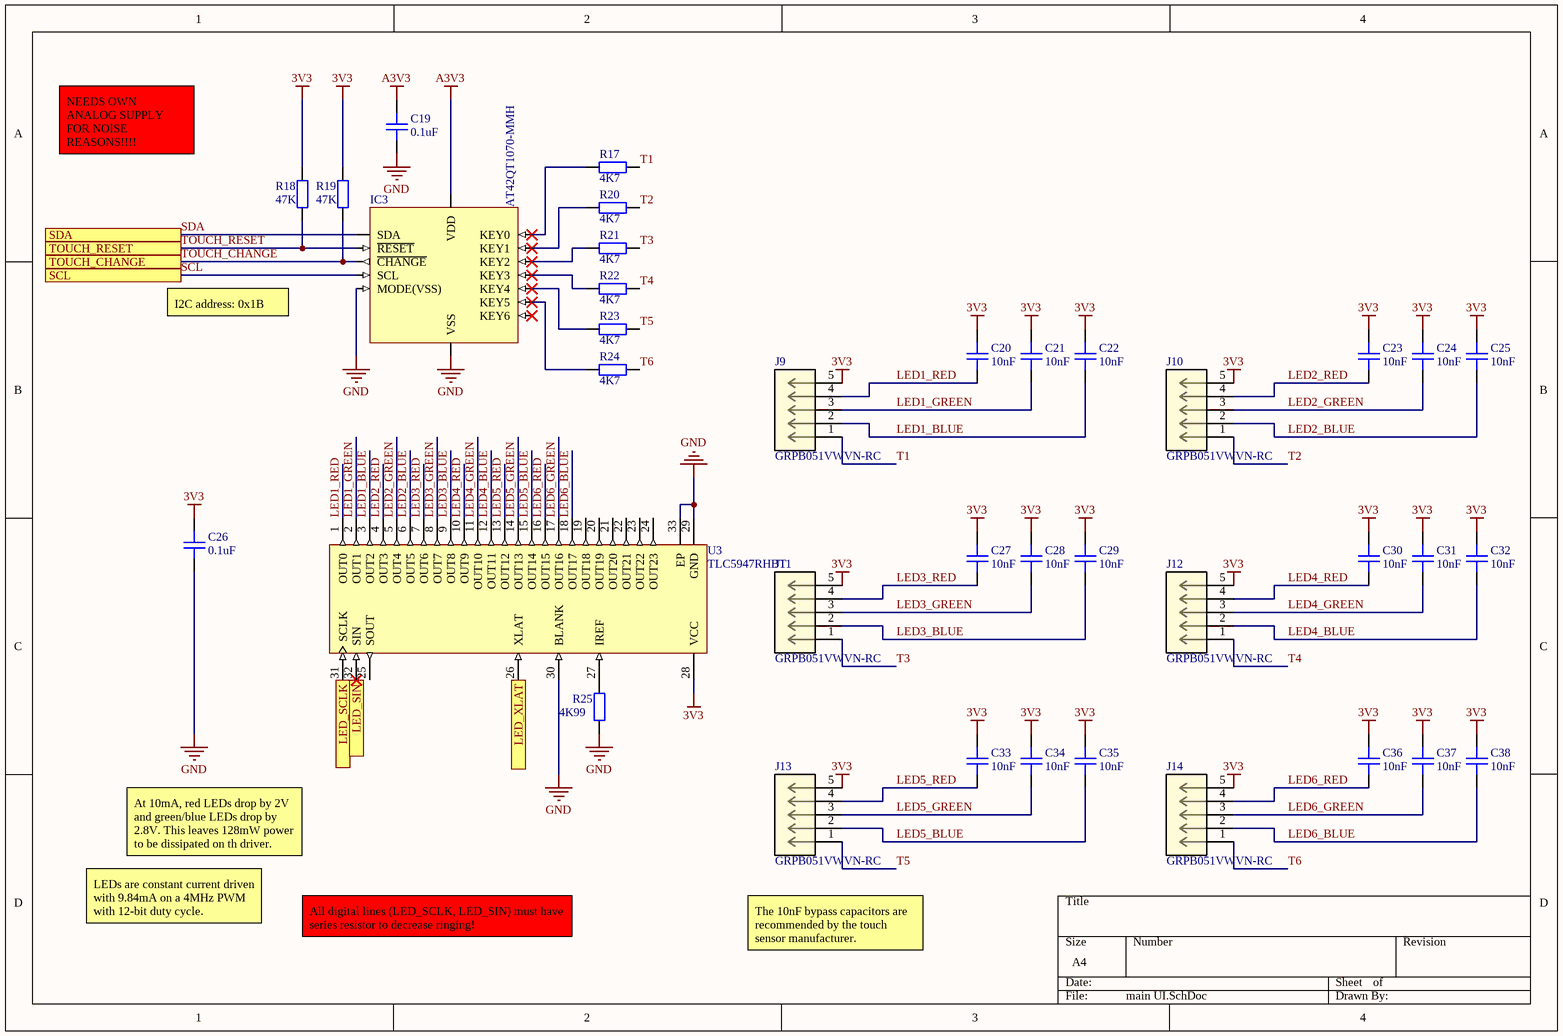
[diagram p5: main UI.SchDoc]

### Parts
C19  0.1uF  [1608[0603]_M]
C20  10nF  [1608[0603]_M]
C21  10nF  [1608[0603]_M]
C22  10nF  [1608[0603]_M]
C23  10nF  [1608[0603]_M]
C24  10nF  [1608[0603]_M]
C25  10nF  [1608[0603]_M]
C26  0.1uF  [1608[0603]_M]
C27  10nF  [1608[0603]_M]
C28  10nF  [1608[0603]_M]
C29  10nF  [1608[0603]_M]
C30  10nF  [1608[0603]_M]
C31  10nF  [1608[0603]_M]
C32  10nF  [1608[0603]_M]
C33  10nF  [1608[0603]_M]
C34  10nF  [1608[0603]_M]
C35  10nF  [1608[0603]_M]
C36  10nF  [1608[0603]_M]
C37  10nF  [1608[0603]_M]
C38  10nF  [1608[0603]_M]
IC3  AT42QT1070-MMH  [VQFN-20-EXPOSED-PAD_M]
J9  GRPB051VWVN-RC  [CONN5_1VWVN-RC_SUL]
J10  GRPB051VWVN-RC  [CONN5_1VWVN-RC_SUL]
J11  GRPB051VWVN-RC  [CONN5_1VWVN-RC_SUL]
J12  GRPB051VWVN-RC  [CONN5_1VWVN-RC_SUL]
J13  GRPB051VWVN-RC  [CONN5_1VWVN-RC_SUL]
J14  GRPB051VWVN-RC  [CONN5_1VWVN-RC_SUL]
R17  4K7  [1608[0603]_M]
R18  47K  [1608[0603]_M]
R19  47K  [1608[0603]_M]
R20  4K7  [1608[0603]_M]
R21  4K7  [1608[0603]_M]
R22  4K7  [1608[0603]_M]
R23  4K7  [1608[0603]_M]
R24  4K7  [1608[0603]_M]
R25  4K99  [1608[0603]_M]
U3  TLC5947RHBT  [RHB0032E_V]

### Ports
LED_SCLK (in), LED_SIN (in), LED_XLAT (in), SCL, SDA, TOUCH_CHANGE, TOUCH_RESET

### Nets
3V3: C20.2 C21.2 C22.2 C23.2 C24.2 C25.2 C26.2 C27.2 C28.2 C29.2 C30.2 C31.2 C32.2 C33.2 C34.2 C35.2 C36.2 C37.2 C38.2 J9.5 J10.5 J11.5 J12.5 J13.5 J14.5 R18.2 R19.2 U3.28(VCC)
A3V3: C19.2 IC3.9(VDD)
GND: C19.1 C26.1 IC3.8(VSS) IC3.11(MODE(VSS)) R25.1 U3.29(GND) U3.30(BLANK) U3.33(EP)
LED1_BLUE: C22.1 J9.2 U3.3(OUT2)
LED1_GREEN: C21.1 J9.3 U3.2(OUT1)
LED1_RED: C20.1 J9.4 U3.1(OUT0)
LED2_BLUE: C25.1 J10.2 U3.6(OUT5)
LED2_GREEN: C24.1 J10.3 U3.5(OUT4)
LED2_RED: C23.1 J10.4 U3.4(OUT3)
LED3_BLUE: C29.1 J11.2 U3.9(OUT8)
LED3_GREEN: C28.1 J11.3 U3.8(OUT7)
LED3_RED: C27.1 J11.4 U3.7(OUT6)
LED4_BLUE: C32.1 J12.2 U3.12(OUT11)
LED4_GREEN: C31.1 J12.3 U3.11(OUT10)
LED4_RED: C30.1 J12.4 U3.10(OUT9)
LED5_BLUE: C35.1 J13.2 U3.15(OUT14)
LED5_GREEN: C34.1 J13.3 U3.14(OUT13)
LED5_RED: C33.1 J13.4 U3.13(OUT12)
LED6_BLUE: C38.1 J14.2 U3.18(OUT17)
LED6_GREEN: C37.1 J14.3 U3.17(OUT16)
LED6_RED: C36.1 J14.4 U3.16(OUT15)
LED_SCLK: U3.31(SCLK) ; port LED_SCLK
LED_SIN: U3.32(SIN) ; port LED_SIN
LED_XLAT: U3.26(XLAT) ; port LED_XLAT
SCL: IC3.15(SCL) ; port SCL
SDA: IC3.12(SDA) ; port SDA
T1: J9.1 R17.1
T2: J10.1 R20.1
T3: J11.1 R21.1
T4: J12.1 R22.1
T5: J13.1 R23.1
T6: J14.1 R24.1
TOUCH_~{CHANGE}: IC3.14(~{CHANGE}) R19.1 ; port TOUCH_CHANGE
TOUCH_~{RESET}: IC3.13(~{RESET}) R18.1 ; port TOUCH_RESET
NetIC3_1: IC3.1(KEY4) R23.2
NetIC3_2: IC3.2(KEY3) R22.2
NetIC3_3: IC3.3(KEY2) R21.2
NetIC3_4: IC3.4(KEY1) R20.2
NetIC3_5: IC3.5(KEY0) R17.2
NetIC3_17: IC3.17(KEY5) R24.2
NetR25_2: R25.2 U3.27(IREF)

Not connected (* = marked no-connect by the designer): IC3 16(KEY6)*; U3 19(OUT18) 20(OUT19) 21(OUT20) 22(OUT21) 23(OUT22) 24(OUT23) 25(SOUT)

### Notes on the sheet
- NEEDS OWN ANALOG SUPPLY FOR NOISE REASONS!!!!
- I2C address: 0x1B
- At 10mA, red LEDs drop by 2V and green/blue LEDs drop by 2.8V. This leaves 128mW power to be dissipated on th driver.
- LEDs are constant current driven with 9.84mA on a 4MHz PWM with 12-bit duty cycle.
- All digital lines (LED_SCLK, LED_SIN) must have series resistor to decrease ringing!
- The 10nF bypass capacitors are recommended by the touch sensor manufacturer.

### Library data of the parts
C19-C38 = Capacitor: Generic Capacitor
  C19 C26: Value: 0.1uF
  C20-C25 C27-C38: Value: 10nF
IC3 = AT42QT1070: Seven-channel capacitive touch sensor (Comms mode)
J9-J14 = GRPB051VWVN-RC: No Description Available; Mfr_Name: Sullins; Copyright: Copyright (C) 2021 Ultra Librarian. All rights reserved.; Manufacturer_Part_Number: GRPB051VWVN-RC; Digi-Key_Part_Number_1: S9014E-05-ND; RefDes: RefDes; Type: DEV
R17-R25 = Resistor: Generic Resistor
  R17 R20-R24: Value: 4K7
  R18 R19: Value: 47K
  R25: Value: 4K99
U3 = CMP-0388-00648-2: 24-Channel, 12-Bit PWM LED Driver with Internal Oscillator, 3 to 5.5 V, -40 to 85 degC, 32-pin QFN (RHB32), Green (RoHS & no Sb/Br); Manufacturer: Texas Instruments; Vin(Max)(V): 5.5; Rating: Catalog; Vin(Min)(V): 3; Eco-Plan: Green (RoHS & no Sb/Br); PackageDescription: 32-Pin Plastic Flat Pack, Body 5 x 5 mm, Pitch 0.5 mm; Code_JEDEC: MO-220; DatasheetVersion: SBVS114A; ComponentLink1URL: http://www.ti.com/; Mounting Technology: Surface Mount; ComponentLink2Description: Datasheet; PackageReference: RHB0032E; ComponentLink3URL: http://www.ti.com/lit/ml/mpqf130c/mpqf130c.pdf; PartNumber: TLC5947RHBT; SubFamily: LED Driver; ComponentLink2URL: http://www.ti.com/general/docs/lit/getliterature.tsp?genericPartNumber=TLC5947&fileType=pdf; ComponentLink1Description: Manufacturer URL; PackageVersion: 4204326/D; ComponentLink3Description: Package Specification

## Nets that join several sheets
3V3: interconnect (J1.10 R29.2 R30.2), ESP32 (C2.2 MD1.2 R1.2 R2.2), power (7 pins), microcontroller (15 pins), optics (11 pins), main UI (28 pins)
5V: ESP32 (P3.1), power (C4.2 U1.2 U1.10)
A3V3: power (C7.1 U2.5), microcontroller (C14.2 IC1.19), optics (5 pins), main UI (C19.2 IC3.9)
GND: interconnect (J1.1 J1.MP1 J1.MP2 P1.4), ESP32 (11 pins), power (15 pins), microcontroller (18 pins), optics (17 pins), main UI (8 pins)
E32_RST: ESP32 (C1.2 MD1.3 R1.1 SW1.2), microcontroller (IC1.31)
IMG_CLK: microcontroller (IC1.44), optics (IC2.47)
IMG_EXPOSURE: microcontroller (IC1.51), optics (IC2.23)
LED_SCLK: microcontroller (IC1.49), main UI (U3.31)
LED_SIN: microcontroller (IC1.47), main UI (U3.32)
LED_XLAT: microcontroller (IC1.48), main UI (U3.26)
NetC5_1: interconnect (J1.2 P1.3), power (7 pins)
NetIC1_4: interconnect (J15.2 R29.1), microcontroller (IC1.4)
NetIC1_5: interconnect (J16.2 R30.1), microcontroller (IC1.5)
NetIC1_6: ESP32 (MD1.36), microcontroller (IC1.6)
NetIC1_10: ESP32 (MD1.31), microcontroller (IC1.10)
NetIC1_11: interconnect (P1.6), microcontroller (IC1.11)
NetIC1_13: interconnect (P1.5), microcontroller (IC1.13)
NetIC1_14: interconnect (J1.8), microcontroller (IC1.14)
NetIC1_17: interconnect (J1.7), microcontroller (IC1.17)
NetIC1_18: interconnect (J1.6), microcontroller (IC1.18)
NetIC1_21: interconnect (J1.5), microcontroller (IC1.21)
NetIC1_22: interconnect (J1.4), microcontroller (IC1.22)
NetIC1_23: interconnect (J1.3), microcontroller (IC1.23)
NetIC1_45: microcontroller (IC1.45), optics (IC2.21)
NetIC1_46: microcontroller (IC1.46), optics (IC2.28 R16.2)
NetIC1_50: microcontroller (IC1.50), optics (IC2.32 R14.1)
NetIC1_56: microcontroller (IC1.56), optics (IC2.33)
NetIC1_57: microcontroller (IC1.57), optics (IC2.20)
NetJ1_9: interconnect (J1.9), optics (Q1.D R26.1 R27.1 R28.1)
PIXEL_D0: microcontroller (IC1.58), optics (IC2.43)
PIXEL_D1: microcontroller (IC1.61), optics (IC2.42)
PIXEL_D2: microcontroller (IC1.62), optics (IC2.41)
PIXEL_D3: microcontroller (IC1.63), optics (IC2.15)
PIXEL_D4: microcontroller (IC1.64), optics (IC2.16)
PIXEL_D5: microcontroller (IC1.1), optics (IC2.17)
PIXEL_D6: microcontroller (IC1.2), optics (IC2.18)
PIXEL_D7: microcontroller (IC1.3), optics (IC2.19)
PIXEL_WR: microcontroller (IC1.52), optics (IC2.46)
SCL: interconnect (P1.2), microcontroller (IC1.42 R7.1), optics (IC2.25), main UI (IC3.15)
SDA: interconnect (P1.1), microcontroller (IC1.41 R8.1), optics (IC2.24), main UI (IC3.12)
TOUCH_~{CHANGE}: microcontroller (IC1.43), main UI (IC3.14 R19.1)
U0RXD: interconnect (J15.1), ESP32 (MD1.34 P2.2)
U0TXD: interconnect (J16.1), ESP32 (MD1.35 P2.1)